# Altium schematic sheet OnePhaseMain.SchDoc: Test of one arm
size A4; CheckedBy: Hildo Guillardi Júnior; Author: Fellipe; Organization: UNICAMP / LCEE; Address1: University of Campinas - Brazil; Address2: Power Conditioning Laboratory; Address3: Licensed by GNU GPL 3.0; PageSetup: Record=PageOptions|CenterHorizontal=True|CenterVertical=True|PrintScale=0.97|XCorrection=1.00|YCorrection=1.00|PrintKind=1|BorderSize=5000000|LeftOffset=0|BottomOffset=0|Orientation=2|PaperLength=1000|PaperWidth=1000|Scale=100|PaperSource=257|PrintQuality=600|MediaType=1|DitherType=10|PrintScaleMode=1|PaperKind=A4|PaperIndex=9; ProjectName: Easy Inverter
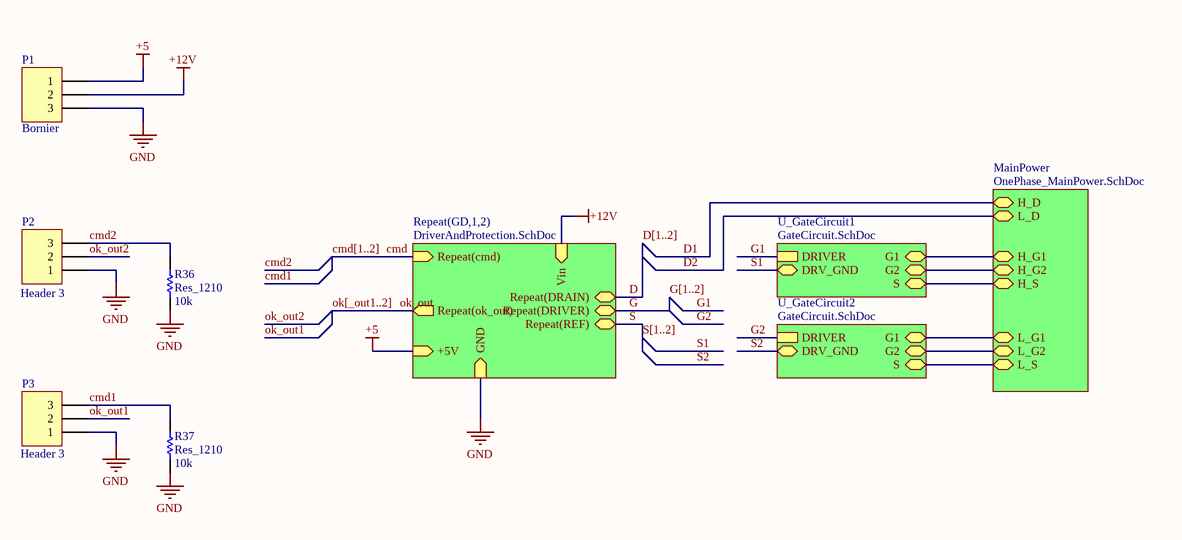
[diagram p0: OnePhaseMain.SchDoc]

## Parts
P1  Bornier  [3 Pin  Borner]
P2  Header 3  [HDR1X3]
P3  Header 3  [HDR1X3]
R36  Res_1210  value 10k  [0805_W]
R37  Res_1210  value 10k  [0805_W]

## Sub-sheets
MainPower = OnePhase_MainPower.SchDoc: H_D, L_D, L_S, H_S, L_G1, H_G1, H_G2, L_G2
Repeat(GD,1,2) = DriverAndProtection.SchDoc: Repeat(cmd) (in), Repeat(DRAIN), Repeat(DRIVER), Repeat(REF), GND (in), Vin (in), +5V (in), Repeat(ok_out) (out)
U_GateCircuit1 = GateCircuit.SchDoc: DRIVER, S, G1, DRV_GND, G2
U_GateCircuit2 = GateCircuit.SchDoc: DRIVER, S, G1, DRV_GND, G2

## Nets
+5: P1.1 ; sheet Repeat(GD,1,2)/+5V
+12V: P1.2 ; sheet Repeat(GD,1,2)/Vin
GND: P1.3 P2.1 P3.1 R36.2 R37.2 ; sheet Repeat(GD,1,2)/GND
cmd: sheet Repeat(GD,1,2)/Repeat(cmd)
cmd1: P3.3 R37.1
cmd2: P2.3 R36.1
D: sheet Repeat(GD,1,2)/Repeat(DRAIN)
D1: sheet MainPower/H_D
D2: sheet MainPower/L_D
G: sheet Repeat(GD,1,2)/Repeat(DRIVER)
G1: sheet U_GateCircuit1/DRIVER
G2: sheet U_GateCircuit2/DRIVER
ok_out: sheet Repeat(GD,1,2)/Repeat(ok_out)
ok_out1: P3.2
ok_out2: P2.2
S: sheet Repeat(GD,1,2)/Repeat(REF)
S1: sheet U_GateCircuit1/DRV_GND
S2: sheet U_GateCircuit2/DRV_GND
(unnamed): sheet MainPower/L_S, sheet U_GateCircuit2/S
(unnamed): sheet MainPower/H_S, sheet U_GateCircuit1/S
(unnamed): sheet MainPower/L_G1, sheet U_GateCircuit2/G1
(unnamed): sheet MainPower/H_G1, sheet U_GateCircuit1/G1
(unnamed): sheet MainPower/H_G2, sheet U_GateCircuit1/G2
(unnamed): sheet MainPower/L_G2, sheet U_GateCircuit2/G2

## Buses and harness runs
bus cmd[1..2]
bus D[1..2]
bus G[1..2]
bus ok[_out1..2]
bus S[1..2]

## Notes on the sheet
- Title
- Author
- Revisor
- Hildo G Jr
- Revision:
- Sheet
- of
- File:
- Size:
- A4
- HGJr

## Library data of the parts
P1 = Header 3: Header, 3-Pin; pn: 1935174; Value: Bornier
P2 P3 = Header 3: Header, 3-Pin; Value: Header 3
R36 R37 = Res_0805: Resistor; pn: RMCF0805JT10K0